# EAGLE schematic card1 (EAGLE 9.3.0)
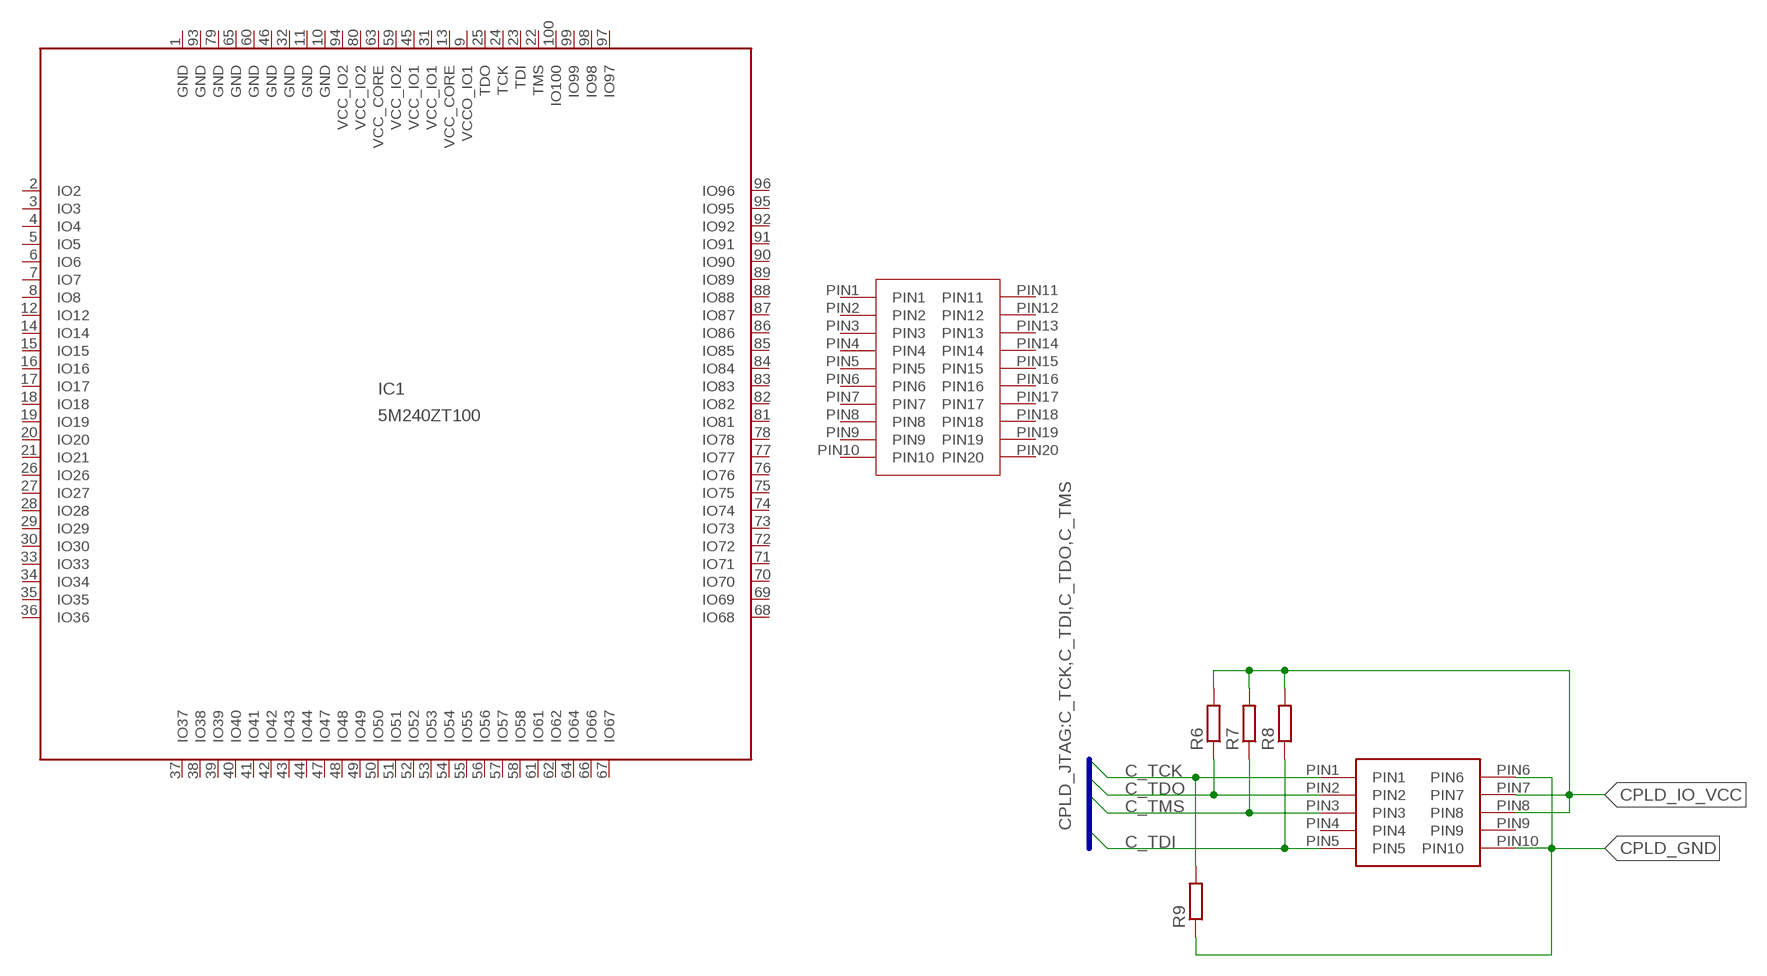
[diagram p0: schematic, sheet 1]

## Parts
IC1  5M240ZT100  [TQFP100]
R6  R-EU_R2012  [R2012]
R7  R-EU_R2012  [R2012]
R8  R-EU_R2012  [R2012]
R9  R-EU_R2012  [R2012]
U$1  10PIN10PIN_BOARD  [10PIN_BOARD]
U$3  CONN-10PINR/A-10PIN  [R/A-10PIN]

## Nets
C_TCK: R9.2 U$3.PIN1
C_TDI: R8.1 U$3.PIN5
C_TDO: R6.1 U$3.PIN2
C_TMS: R7.1 U$3.PIN3
CPLD_GND: R9.1 U$3.PIN6 U$3.PIN10
CPLD_IO_VCC: R6.2 R7.2 R8.2 U$3.PIN7 U$3.PIN8
Unconnected: IC1.2(IO2) IC1.3(IO3) IC1.4(IO4) IC1.5(IO5) IC1.6(IO6) IC1.7(IO7) IC1.8(IO8) IC1.12(IO12) IC1.14(IO14) IC1.15(IO15) IC1.16(IO16) IC1.17(IO17) IC1.18(IO18) IC1.19(IO19) IC1.20(IO20) IC1.21(IO21) IC1.22(TMS) IC1.23(TDI) IC1.24(TCK) IC1.25(TDO) IC1.26(IO26) IC1.27(IO27) IC1.28(IO28) IC1.29(IO29) IC1.30(IO30) IC1.33(IO33) IC1.34(IO34) IC1.35(IO35) IC1.36(IO36) IC1.37(IO37) IC1.38(IO38) IC1.39(IO39) IC1.40(IO40) IC1.41(IO41) IC1.42(IO42) IC1.43(IO43) IC1.44(IO44) IC1.47(IO47) IC1.48(IO48) IC1.49(IO49) IC1.50(IO50) IC1.51(IO51) IC1.52(IO52) IC1.53(IO53) IC1.54(IO54) IC1.55(IO55) IC1.56(IO56) IC1.57(IO57) IC1.58(IO58) IC1.61(IO61) IC1.62(IO62) IC1.64(IO64) IC1.66(IO66) IC1.67(IO67) IC1.68(IO68) IC1.69(IO69) IC1.70(IO70) IC1.71(IO71) IC1.72(IO72) IC1.73(IO73) IC1.74(IO74) IC1.75(IO75) IC1.76(IO76) IC1.77(IO77) IC1.78(IO78) IC1.81(IO81) IC1.82(IO82) IC1.83(IO83) IC1.84(IO84) IC1.85(IO85) IC1.86(IO86) IC1.87(IO87) IC1.88(IO88) IC1.89(IO89) IC1.90(IO90) IC1.91(IO91) IC1.92(IO92) IC1.95(IO95) IC1.96(IO96) IC1.97(IO97) IC1.98(IO98) IC1.99(IO99) IC1.100(IO100) U$1.PIN1 U$1.PIN2 U$1.PIN3 U$1.PIN4 U$1.PIN5 U$1.PIN6 U$1.PIN7 U$1.PIN8 U$1.PIN9 U$1.PIN10 U$1.PIN11 U$1.PIN12 U$1.PIN13 U$1.PIN14 U$1.PIN15 U$1.PIN16 U$1.PIN17 U$1.PIN18 U$1.PIN19 U$1.PIN20 U$3.PIN4 U$3.PIN9

## Buses
CPLD_JTAG:C_TCK,C_TDI,C_TDO,C_TMS

## Power pins joined to a net without a drawn wire
GND: IC1.1(GND) IC1.10(GND) IC1.11(GND) IC1.32(GND) IC1.46(GND) IC1.60(GND) IC1.65(GND) IC1.79(GND) IC1.93(GND)
VCC_CORE: IC1.13(VCC_CORE) IC1.63(VCC_CORE)
VCC_IO1: IC1.31(VCC_IO1) IC1.45(VCC_IO1)
VCC_IO2: IC1.59(VCC_IO2) IC1.80(VCC_IO2) IC1.94(VCC_IO2)
VCCO_IO1: IC1.9(VCCO_IO1)

## Library data of the parts
IC1 = ORBiT-IC-CPLD-Intel-MAX_V:5M240ZT100: 5M240ZT100 Auto generated by make-symbol-device-package-bsdl.ulp Rev. 44 This devide should suitable for any MAX V 5M240ZT100*** Source: 5M240ZT100.bsd https://www.intel.com/content/dam/altera-www/global/en_US/others/support/devices/bsdl/5M240ZT100.bsd
R6-R9 = rcl:R-EU_: RESISTOR, European symbol; SPICEPREFIX: R
U$1 = ORBiT-con-CardEdge:10PIN
U$3 = ORBIT-CONN HEADER-3M-2500 Series:CONN-10PIN: 3M-CONN-RIGHT_ANGLE-10PIN CONN HEADER R/A 10POS 2.54MM N2510-5002-RB https://www.digikey.com/product-detail/en/3m/N2510-5002-RB/MHE10K-ND/755188 CONN HEADER SMD 10POS 2.54MM N2510-6V0C-RB-WD https://www.digikey.com/product-detail/en/3m/N2510-6V0C-RB-WD/MSH10KTR-ND/1125434 CONN HEADER VERT 10POS 2.54MM N2510-6002-RB https://www.digikey.com/product-detail/en/3m/N2510-6002-RB/MHC10K-ND/755176